# Altium schematic sheet alimentation.SchDoc: Alimentation
size A4; Author: Taboada Adrien
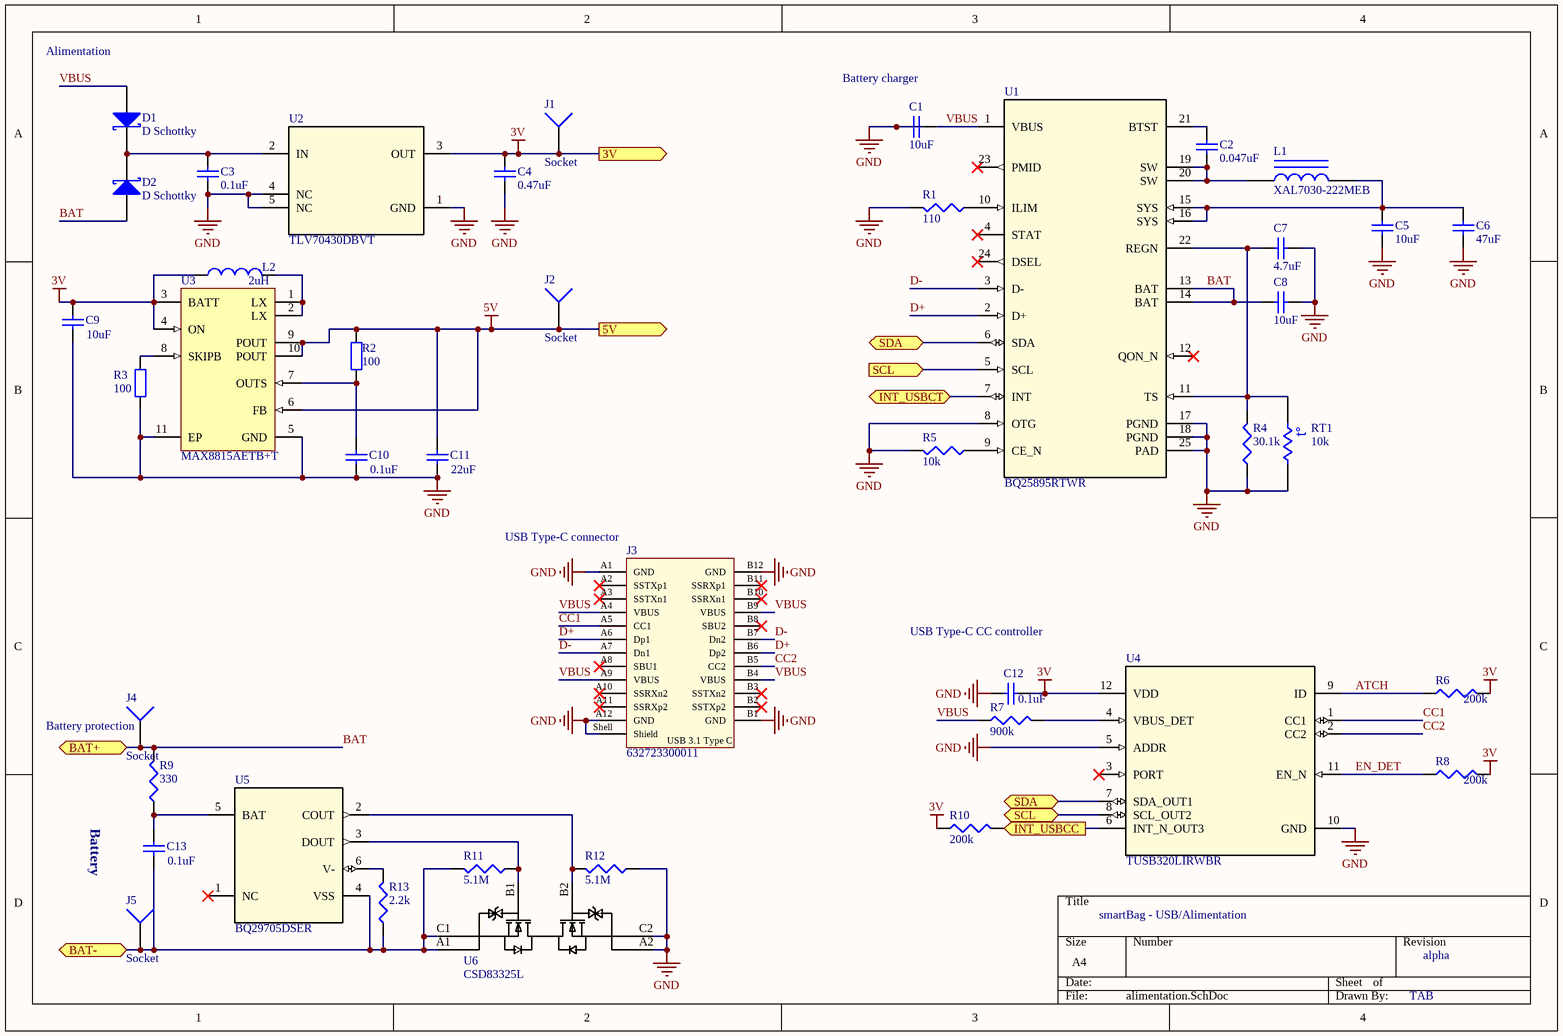
[diagram p0: alimentation.SchDoc]

## Parts
C1  10uF  [1608[0603]]
C2  0.047uF  [1608[0603]]
C3  0.1uF  [1608[0603]]
C4  0.47uF  [1608[0603]]
C5  10uF  [1608[0603]]
C6  47uF  [1608[0603]]
C7  4.7uF  [1608[0603]]
C8  10uF  [1608[0603]]
C9  10uF  [1608[0603]]
C10  0.1uF  [1608[0603]]
C11  22uF  [1608[0603]]
C12  0.1uF  [1608[0603]]
C13  0.1uF  [1608[0603]]
D1  D Schottky  [SMB]
D2  D Schottky  [SMB]
J1  Socket  [PIN1]
J2  Socket  [PIN1]
J3  632723300011  [632723300011]
J4  Socket  [PIN1]
J5  Socket  [PIN1]
L1  XAL7030-222MEB  [DFN472P750X310-2N]
L2  2uH  [0603]
R1  110  [J1-0603]
R2  100  [6-0805_N]
R3  100  [6-0805_N]
R4  30.1k  [J1-0603]
R5  10k  [J1-0603]
R6  200k  [J1-0603]
R7  900k  [J1-0603]
R8  200k  [J1-0603]
R9  330  [J1-0603]
R10  200k  [J1-0603]
R11  5.1M  [J1-0603]
R12  5.1M  [J1-0603]
R13  2.2k  [J1-0603]
RT1  10k  [6-0805_N]
U1  BQ25895RTWR  [RTW0024H]
U2  TLV70430DBVT  [DBV0005A_N]
U3  MAX8815AETB+T  [T1033+2_M]
U4  TUSB320LIRWBR  [RWB0012A]
U5  BQ29705DSER  [DSE0006A]
U6  CSD83325L  [YJE0006A]

## Ports
3V (out), 5V (out), BAT+, BAT-, INT_USBCC (out), INT_USBCT (bidir), SCL (bidir), SCL (in), SDA (bidir)

## Nets
3V: C4.2 C9.2 C12.2 J1.1 L2.1 R6.2 R8.2 R10.1 U2.3(OUT) U3.3(BATT) U3.4(ON) U4.12(VDD) ; port 3V
5V: C11.2 J2.1 R2.1 U3.6(FB) U3.9(POUT) U3.10(POUT) ; port 5V
GND: C1.2 C3.1 C4.1 C5.2 C6.2 C7.1 C8.1 C9.1 C10.1 C11.1 C12.1 J3.A1(GND) J3.A12(GND) J3.B1(GND) J3.B12(GND) J3.Shell(Shield) R1.2 R3.2 R4.1 R5.2 R12.1 RT1.2 U1.8(OTG) U1.17(PGND) U1.18(PGND) U1.25(PAD) U2.1(GND) U2.4(NC) U2.5(NC) U3.5(GND) U3.11(EP) U4.5(ADDR) U4.10(GND) U6.A2(S2) U6.C2(S2)
ATCH: R6.1 U4.9(ID)
BAT: C8.2 D2.1(A) J4.1 R9.2 U1.13(BAT) U1.14(BAT) ; port BAT+
BAT-: C13.1 J5.1 R11.2 R13.1 U5.4(VSS) U6.A1(S1) U6.C1(S1) ; port BAT-
CC1: J3.A5(CC1) U4.1(CC1)
CC2: J3.B5(CC2) U4.2(CC2)
D+: J3.A6(Dp1) J3.B6(Dp2) U1.2(D+)
D-: J3.A7(Dn1) J3.B7(Dn2) U1.3(D-)
EN_DET: R8.1 U4.11(EN_N)
INT_USBCC: R10.2 U4.6(INT_N_OUT3) ; port INT_USBCC
INT_USBCT: U1.7(INT) ; port INT_USBCT
SCL: U1.5(SCL) U4.8(SCL_OUT2) ; port SCL
SDA: U1.6(SDA) U4.7(SDA_OUT1) ; port SDA
VBUS: C1.1 D1.1(A) J3.A4(VBUS) J3.A9(VBUS) J3.B4(VBUS) J3.B9(VBUS) R7.1 U1.1(VBUS)
NetC2_1: C2.1 U1.21(BTST)
NetC2_2: C2.2 L1.1 U1.19(SW) U1.20(SW)
NetC3_2: C3.2 D1.2(K) D2.2(K) U2.2(IN)
NetC5_1: C5.1 C6.1 L1.2 U1.15(SYS) U1.16(SYS)
NetC7_2: C7.2 R4.2 RT1.1 U1.11(TS) U1.22(REGN)
NetC10_2: C10.2 R2.2 U3.7(OUTS)
NetC13_2: C13.2 R9.1 U5.5(BAT)
NetL2_2: L2.2 U3.1(LX) U3.2(LX)
NetR1_1: R1.1 U1.10(ILIM)
NetR3_1: R3.1 U3.8(SKIPB)
NetR5_1: R5.1 U1.9(CE_N)
NetR7_2: R7.2 U4.4(VBUS_DET)
NetR11_1: R11.1 U5.3(DOUT) U6.B1(G1)
NetR12_2: R12.2 U5.2(COUT) U6.B2(G2)
NetR13_2: R13.2 U5.6(V-)

Not connected (* = marked no-connect by the designer): J3 A2(SSTXp1)* A3(SSTXn1)* A8(SBU1)* A10(SSRXn2)* A11(SSRXp2)* B2(SSTXp2)* B3(SSTXn2)* B8(SBU2)* B10(SSRXn1)* B11(SSRXp1)*; U1 4(STAT)* 12(QON_N)* 23(PMID)* 24(DSEL)*; U4 3(PORT)*; U5 1(NC)*

## Notes on the sheet
- Alimentation
- (near C1) Battery charger
- (near J3) USB Type-C connector
- USB Type-C CC controller
- (near J4) Battery protection
- Battery
- smartBag - USB/Alimentation
- alpha
- TAB
- (in symbol 632723300011) USB 3.1 Type C
- (in symbol Res Thermal) t°

## Library data of the parts
C1-C13 = Cap Semi: Capacitor (Semiconductor SIM Model); Published: 8-Jun-2000; LatestRevisionDate: 29-May-2009; LatestRevisionNote: IPC-7351 Footprint Added.; Publisher: Altium Limited; PackageDescription: Chip Capacitor
  C1: PackageReference: C1206; Value: 10uF
  C2: PackageReference: C0603; Value: 0.047uF
  C3 C12: PackageReference: C1206; Value: 0.1uF
  C4: PackageReference: C1206; Value: 0.47uF
  C5 C8 C9: PackageReference: C0603; Value: 10uF
  C6: PackageReference: C0603; Value: 47uF
  C7: PackageReference: C0603; Value: 4.7uF
  C10 C13: PackageReference: C0603; Value: 0.1uF
  C11: PackageReference: C0603; Value: 22uF
D1 D2 = D Schottky: Schottky Diode; Published: 8-Jun-2000; LatestRevisionDate: 17-Jul-2002; LatestRevisionNote: Re-released for DXP Platform.; PackageReference: SMB; Publisher: Altium Limited; PackageDescription: DO-214-AA/SMB; 2 C-Bend Leads; Body 5.3 x 3.6 mm, inc. leads (LxW); Code_JEDEC: DO-214-AA
J3 = 632723300011: USB 3.1 Type C Receptacle Horizontal THR WR-COM; Interface Type: Type C; Sub-Family: USB 3.1; ComponentLink1Description: Manufacturer; ComponentLink1URL: http://www.we-online.de; ComponentLink2Description: Datasheet; ComponentLink2URL: http://katalog.we-online.de/em/datasheet/632723x00011.pdf; Part Number: 632723300011; Published Date: April 2017; Publisher: Wurth Elektronik; Gender: Receptacle; Type: Horizontal; Construction: THR
L1 = Inductor Iron: Magnetic-Core Inductor; Published: 24-Mar-1999; LatestRevisionDate: 17-Jul-2002; LatestRevisionNote: Re-released for DXP Platform.; PackageReference: AXIAL-0.9; Publisher: Altium Limited; PackageDescription: Axial Device, Thru-Hole; 2 Leads; 0.9 in Pin Spacing; Value: XAL7030-222MEB
L2 = Inductor: Code_IEC: 1005; Published: 8-Jun-2000; LatestRevisionDate: 29-May-2009; LatestRevisionNote: IPC-7351 Footprint Added.; PackageReference: 0402-A; Publisher: Altium Limited; PackageDescription: Chip Inductor; Code_JEITA: 0402; Value: 2uH
R1 R4-R13 = Res3: Resistor; Published: 8-Jun-2000; LatestRevisionDate: 29-May-2009; LatestRevisionNote: IPC-7351 Footprint Added.; PackageReference: J1-0603; Publisher: Altium Limited; PackageDescription: Chip Resistor
  R1: Value: 110
  R4: Value: 30.1k
  R5: Value: 10k
  R6 R8 R10: Value: 200k
  R7: Value: 900k
  R9: Value: 330
  R11 R12: Value: 5.1M
  R13: Value: 2.2k
R2 R3 = Res2: Resistor; Published: 8-Jun-2000; LatestRevisionDate: 17-Jul-2002; LatestRevisionNote: Re-released for DXP Platform.; PackageReference: AXIAL-0.4; Publisher: Altium Limited; PackageDescription: Axial Device, Thru-Hole; 2 Leads; 0.4 in Pin Spacing; Value: 100
RT1 = Res Thermal: Thermistor; Published: 24-Mar-1999; LatestRevisionDate: 29-May-2009; LatestRevisionNote: IPC-7351 Footprint Added.; PackageVersion: Mar-2003; PackageReference: 6-0805; Publisher: Altium Limited; PackageDescription: Chip Resistor 0805 Case Size; Code_IPC: RESC2012; Value: 10k
U1 = BQ25895RTWR: Battery charger; Alternate_PartNumber: BQ25895RTWT; Manufacturer: Texas Instruments; CompType: IC; PIN_COUNT: 25; Application_BuildNumber: *; PartNumber: BQ25895RTWR; PackageReference: RTW0024H; MountType: SMT; RefDes: RefDes; TYPE: TYPE; Value: Value
U2 = TLV70430DBVR: Regulator 3V; Manufacturer: Texas Instruments; PartNumber: TLV70430DBVT; RefDes: RefDes; TYPE: TYPE; Value: Value
U3 = CMP-0246-00645-1: 1A, 97% Efficiency, 30uA Quiescent Current, Step-Up Converter with True Shutdown(TM), 10-Pin TDFN-EP, -40°C to +85°C, Pb-Free, Tape and Reel; PackageReference: T1033+2; PackageVersion: revJ, 2009; ComponentLink1Description: Manufacturer URL; ComponentLink3URL: http://pdfserv.maxim-ic.com/package_dwgs/21-0137.PDF; ComponentLink3Description: Package Specification; DatasheetVersion: Rev 1, Aug-2008; ComponentLink2URL: http://datasheets.maxim-ic.com/en/ds/MAX8815A.pdf; Code_JEDEC: MO-229-WEED-3; PackageDescription: 10-Pin Plastic Very Very Thin Dual Flatpack No Leads, Exposed Pad, 3 x 3 x 0.8 mm Body, TDFN-EP, Pb-Free; ComponentLink1URL: http://www.maxim-ic.com; ComponentLink2Description: Datasheet
U4 = TUSB320LIRWBR: USB Type-C Configuration Channel Logic and Port Control; Manufacturer: Texas Instruments; CompType: IC; PIN_COUNT: 12; Application_BuildNumber: *; PartNumber: TUSB320LIRWBR; PackageReference: RWB0012A; MountType: SMT; RoHS: Y; RefDes: RefDes; TYPE: TYPE; Value: Value
U5 = BQ29705DSER: Battery protection; Manufacturer: Texas Instruments; PartNumber: BQ29705DSER; RefDes: RefDes; TYPE: TYPE; Value: Value
U6 = CSD83325L: MOSFET; Manufacturer: Texas Instruments; ChType: N; Value: V; Value1: ? ohm; Value2: 8.4 nC; QgTyp_nC: 8.4; Vgs_V: 10; PIN_COUNT: 6; VALUE_2: Value; PartNumber: CSD83325L; PackageReference: LGA, 6-Leads, Body 2.16x1.11mm, Pitch 0.65mm; CompType: MOSFET; RoHS: Y; MountType: SMT; Published: 2008-06-19; LatestRevisionNote: Added parts.; Supplier_1: Digi-Key; Supplier_Part_Number_1: CSD83325L-ND; Supplier_2: Mouser; Supplier_Part_Number_2: 595-CSD83325L; RefDes: RefDes; TYPE: TYPE; Value: Value
J1 J2 J4 J5 = Socket: LatestRevisionDate: 17-Jul-2002; LatestRevisionNote: Re-released for DXP Platform.; Publisher: Altium Limited